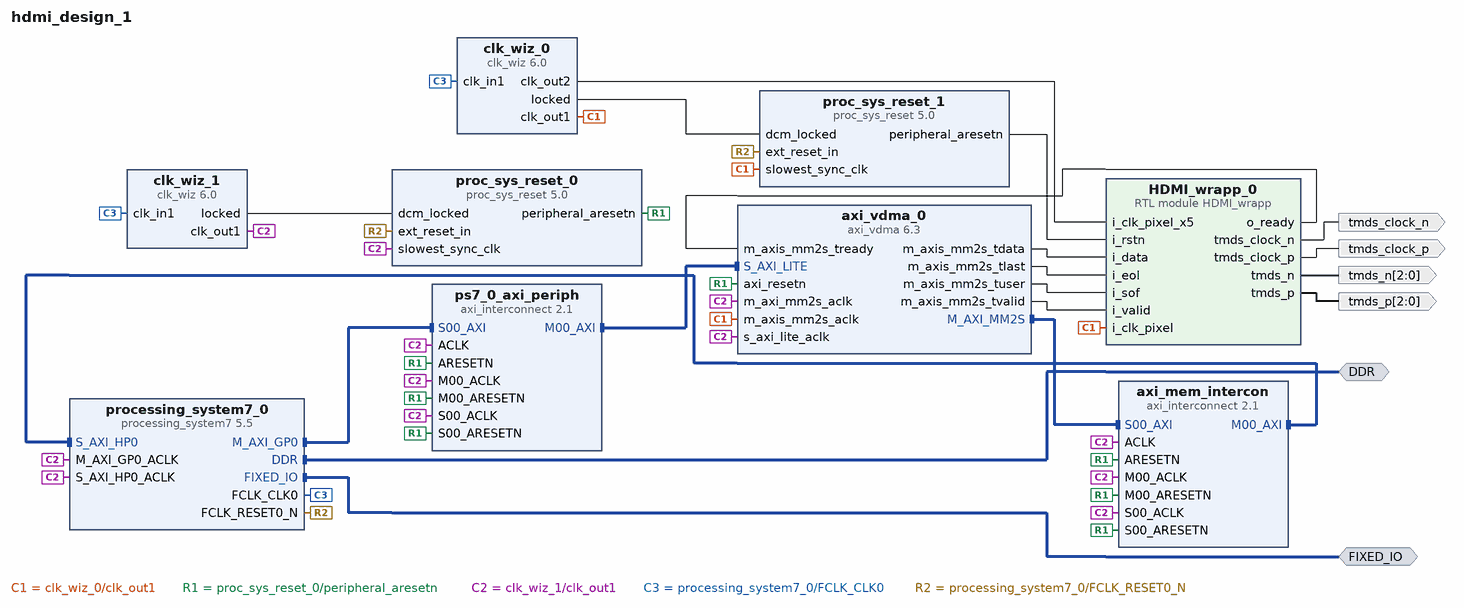
[diagram p0: block diagram of the top level]
# Vivado block design hdmi_design_1, xc7z010clg400-1, Vivado 2020.1
create_bd_design hdmi_design_1

create_bd_intf_port -mode Master -vlnv xilinx.com:interface:ddrx_rtl:1.0 DDR
create_bd_intf_port -mode Master -vlnv xilinx.com:display_processing_system7:fixedio_rtl:1.0 FIXED_IO
create_bd_port -dir O -from 2 -to 0 tmds_p
create_bd_port -dir O -from 2 -to 0 tmds_n
create_bd_port -dir O tmds_clock_p
create_bd_port -dir O tmds_clock_n

create_bd_cell -type ip -vlnv xilinx.com:ip:clk_wiz:6.0 clk_wiz_0
set_property -dict [list \
  CONFIG.CLKIN1_JITTER_PS 100.0 \
  CONFIG.CLKOUT1_JITTER 337.616 \
  CONFIG.CLKOUT1_PHASE_ERROR 322.999 \
  CONFIG.CLKOUT1_REQUESTED_OUT_FREQ 74.250 \
  CONFIG.CLKOUT2_JITTER 232.529 \
  CONFIG.CLKOUT2_PHASE_ERROR 322.999 \
  CONFIG.CLKOUT2_REQUESTED_OUT_FREQ 742.500 \
  CONFIG.CLKOUT2_USED true \
  CONFIG.MMCM_CLKFBOUT_MULT_F 37.125 \
  CONFIG.MMCM_CLKIN1_PERIOD 10.000 \
  CONFIG.MMCM_CLKIN2_PERIOD 10.000 \
  CONFIG.MMCM_CLKOUT0_DIVIDE_F 10.000 \
  CONFIG.MMCM_CLKOUT1_DIVIDE 1 \
  CONFIG.MMCM_DIVCLK_DIVIDE 5 \
  CONFIG.NUM_OUT_CLKS 2 \
  CONFIG.PRIM_IN_FREQ 100.000 \
  CONFIG.USE_RESET false \
] [get_bd_cells clk_wiz_0]
create_bd_cell -type ip -vlnv xilinx.com:ip:proc_sys_reset:5.0 proc_sys_reset_0
set_property -dict {CONFIG.C_AUX_RESET_HIGH 1} [get_bd_cells proc_sys_reset_0]
create_bd_cell -type ip -vlnv xilinx.com:ip:axi_interconnect:2.1 ps7_0_axi_periph
set_property -dict {CONFIG.NUM_MI 1} [get_bd_cells ps7_0_axi_periph]
create_bd_cell -type ip -vlnv xilinx.com:ip:axi_vdma:6.3 axi_vdma_0
set_property -dict [list \
  CONFIG.c_include_mm2s_dre 1 \
  CONFIG.c_include_s2mm 0 \
  CONFIG.c_m_axis_mm2s_tdata_width 24 \
  CONFIG.c_mm2s_linebuffer_depth 512 \
  CONFIG.c_num_fstores 1 \
] [get_bd_cells axi_vdma_0]
create_bd_cell -type ip -vlnv xilinx.com:ip:axi_interconnect:2.1 axi_mem_intercon
set_property -dict {CONFIG.NUM_MI 1} [get_bd_cells axi_mem_intercon]
create_bd_cell -type ip -vlnv xilinx.com:ip:processing_system7:5.5 processing_system7_0
set_property -dict [list \
  CONFIG.PCW_FPGA0_PERIPHERAL_FREQMHZ 100 \
  CONFIG.PCW_S_AXI_HP0_DATA_WIDTH 32 \
  CONFIG.PCW_UART1_PERIPHERAL_ENABLE 1 \
  CONFIG.PCW_UART1_UART1_IO {MIO 48 .. 49} \
  CONFIG.PCW_UART_PERIPHERAL_FREQMHZ 100 \
  CONFIG.PCW_UIPARAM_DDR_PARTNO {MT41K128M16 HA-15E} \
  CONFIG.PCW_USE_S_AXI_HP0 1 \
] [get_bd_cells processing_system7_0]
# 46 more settings of processing_system7_0 are not shown: defaults, MIO pin electricals, DDR timing, and values the tool derives
create_bd_cell -type module -reference HDMI_wrapp HDMI_wrapp_0
create_bd_cell -type ip -vlnv xilinx.com:ip:clk_wiz:6.0 clk_wiz_1
set_property -dict [list \
  CONFIG.CLKIN1_JITTER_PS 100.0 \
  CONFIG.CLKOUT1_JITTER 130.958 \
  CONFIG.CLKOUT1_PHASE_ERROR 98.575 \
  CONFIG.MMCM_CLKFBOUT_MULT_F 10.000 \
  CONFIG.MMCM_CLKIN1_PERIOD 10.000 \
  CONFIG.MMCM_CLKIN2_PERIOD 10.000 \
  CONFIG.PRIM_IN_FREQ 100.000 \
  CONFIG.USE_RESET false \
] [get_bd_cells clk_wiz_1]
create_bd_cell -type ip -vlnv xilinx.com:ip:proc_sys_reset:5.0 proc_sys_reset_1

# ---- connections ----

connect_bd_intf_net [get_bd_intf_pins ps7_0_axi_periph/M00_AXI] [get_bd_intf_pins axi_vdma_0/S_AXI_LITE]
connect_bd_intf_net [get_bd_intf_ports DDR] [get_bd_intf_pins processing_system7_0/DDR]
connect_bd_intf_net [get_bd_intf_pins axi_mem_intercon/M00_AXI] [get_bd_intf_pins processing_system7_0/S_AXI_HP0]
connect_bd_intf_net [get_bd_intf_pins axi_vdma_0/M_AXI_MM2S] [get_bd_intf_pins axi_mem_intercon/S00_AXI]
connect_bd_intf_net [get_bd_intf_pins ps7_0_axi_periph/S00_AXI] [get_bd_intf_pins processing_system7_0/M_AXI_GP0]
connect_bd_intf_net [get_bd_intf_ports FIXED_IO] [get_bd_intf_pins processing_system7_0/FIXED_IO]
connect_bd_net [get_bd_pins clk_wiz_0/clk_out2] [get_bd_pins HDMI_wrapp_0/i_clk_pixel_x5]
connect_bd_net [get_bd_pins clk_wiz_0/clk_out1] \
  [get_bd_pins HDMI_wrapp_0/i_clk_pixel] [get_bd_pins axi_vdma_0/m_axis_mm2s_aclk] \
  [get_bd_pins proc_sys_reset_1/slowest_sync_clk]
connect_bd_net [get_bd_pins HDMI_wrapp_0/tmds_p] [get_bd_ports tmds_p]
connect_bd_net [get_bd_pins HDMI_wrapp_0/tmds_n] [get_bd_ports tmds_n]
connect_bd_net [get_bd_pins HDMI_wrapp_0/tmds_clock_p] [get_bd_ports tmds_clock_p]
connect_bd_net [get_bd_pins HDMI_wrapp_0/tmds_clock_n] [get_bd_ports tmds_clock_n]
connect_bd_net [get_bd_pins axi_vdma_0/m_axis_mm2s_tdata] [get_bd_pins HDMI_wrapp_0/i_data]
connect_bd_net [get_bd_pins axi_vdma_0/m_axis_mm2s_tlast] [get_bd_pins HDMI_wrapp_0/i_eol]
connect_bd_net [get_bd_pins axi_vdma_0/m_axis_mm2s_tuser] [get_bd_pins HDMI_wrapp_0/i_sof]
connect_bd_net [get_bd_pins axi_vdma_0/m_axis_mm2s_tvalid] [get_bd_pins HDMI_wrapp_0/i_valid]
connect_bd_net [get_bd_pins HDMI_wrapp_0/o_ready] [get_bd_pins axi_vdma_0/m_axis_mm2s_tready]
connect_bd_net [get_bd_pins proc_sys_reset_1/peripheral_aresetn] [get_bd_pins HDMI_wrapp_0/i_rstn]
connect_bd_net [get_bd_pins proc_sys_reset_0/peripheral_aresetn] \
  [get_bd_pins ps7_0_axi_periph/M00_ARESETN] [get_bd_pins ps7_0_axi_periph/S00_ARESETN] \
  [get_bd_pins ps7_0_axi_periph/ARESETN] [get_bd_pins axi_vdma_0/axi_resetn] [get_bd_pins axi_mem_intercon/ARESETN] \
  [get_bd_pins axi_mem_intercon/S00_ARESETN] [get_bd_pins axi_mem_intercon/M00_ARESETN]
connect_bd_net [get_bd_pins clk_wiz_1/locked] [get_bd_pins proc_sys_reset_0/dcm_locked]
connect_bd_net [get_bd_pins clk_wiz_1/clk_out1] \
  [get_bd_pins proc_sys_reset_0/slowest_sync_clk] [get_bd_pins ps7_0_axi_periph/ACLK] [get_bd_pins ps7_0_axi_periph/S00_ACLK] \
  [get_bd_pins ps7_0_axi_periph/M00_ACLK] [get_bd_pins axi_vdma_0/s_axi_lite_aclk] [get_bd_pins axi_vdma_0/m_axi_mm2s_aclk] \
  [get_bd_pins axi_mem_intercon/ACLK] [get_bd_pins axi_mem_intercon/S00_ACLK] [get_bd_pins axi_mem_intercon/M00_ACLK] \
  [get_bd_pins processing_system7_0/M_AXI_GP0_ACLK] [get_bd_pins processing_system7_0/S_AXI_HP0_ACLK]
connect_bd_net [get_bd_pins processing_system7_0/FCLK_CLK0] [get_bd_pins clk_wiz_1/clk_in1] [get_bd_pins clk_wiz_0/clk_in1]
connect_bd_net [get_bd_pins clk_wiz_0/locked] [get_bd_pins proc_sys_reset_1/dcm_locked]
connect_bd_net [get_bd_pins processing_system7_0/FCLK_RESET0_N] \
  [get_bd_pins proc_sys_reset_1/ext_reset_in] [get_bd_pins proc_sys_reset_0/ext_reset_in]

# ---- address map ----
assign_bd_address -offset 0x00000000 -range 512M -target_address_space [get_bd_addr_spaces axi_vdma_0/Data_MM2S] [get_bd_addr_segs processing_system7_0/S_AXI_HP0/HP0_DDR_LOWOCM]
assign_bd_address -offset 0x43000000 -range 64K -target_address_space [get_bd_addr_spaces processing_system7_0/Data] [get_bd_addr_segs axi_vdma_0/S_AXI_LITE/Reg]

validate_bd_design
save_bd_design
